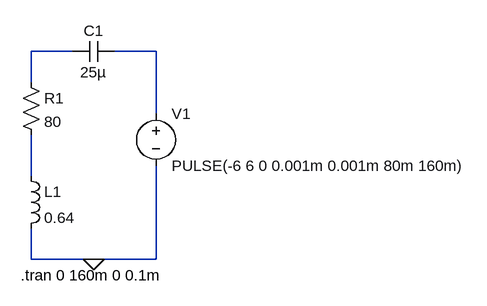
[diagram p0: schematic tran22.asc]
tran22.asc, the LTspice schematic file:
Version 4
SHEET 1 880 680
WIRE -32 48 -96 48
WIRE 96 48 32 48
WIRE -96 96 -96 48
WIRE 96 144 96 48
WIRE -96 240 -96 176
WIRE -96 368 -96 320
WIRE 0 368 -96 368
WIRE 96 368 96 224
WIRE 96 368 0 368
FLAG 0 368 0
SYMBOL voltage 96 128 R0
WINDOW 123 0 0 Left 0
WINDOW 39 0 0 Left 0
SYMATTR InstName V1
SYMATTR Value PULSE(-6 6 0 0.001m 0.001m 80m 160m)
SYMBOL res -112 80 R0
SYMATTR InstName R1
SYMATTR Value 80
SYMBOL ind -112 224 R0
SYMATTR InstName L1
SYMATTR Value 0.64
SYMBOL cap 32 32 R90
WINDOW 0 0 32 VBottom 2
WINDOW 3 32 32 VTop 2
SYMATTR InstName C1
SYMATTR Value 25µ
TEXT -112 392 Left 2 !.tran 0 160m 0 0.1m

The netlist it stands for:
* tran22.asc
V1 N002 0 PULSE(-6 6 0 0.001m 0.001m 80m 160m)
R1 N001 N003 80
L1 N003 0 0.64
C1 N002 N001 25µ
.tran 0 160m 0 0.1m
.backanno
.end